# Altium schematic sheet exhaust-fan-control-circuit.SchDoc
size A4
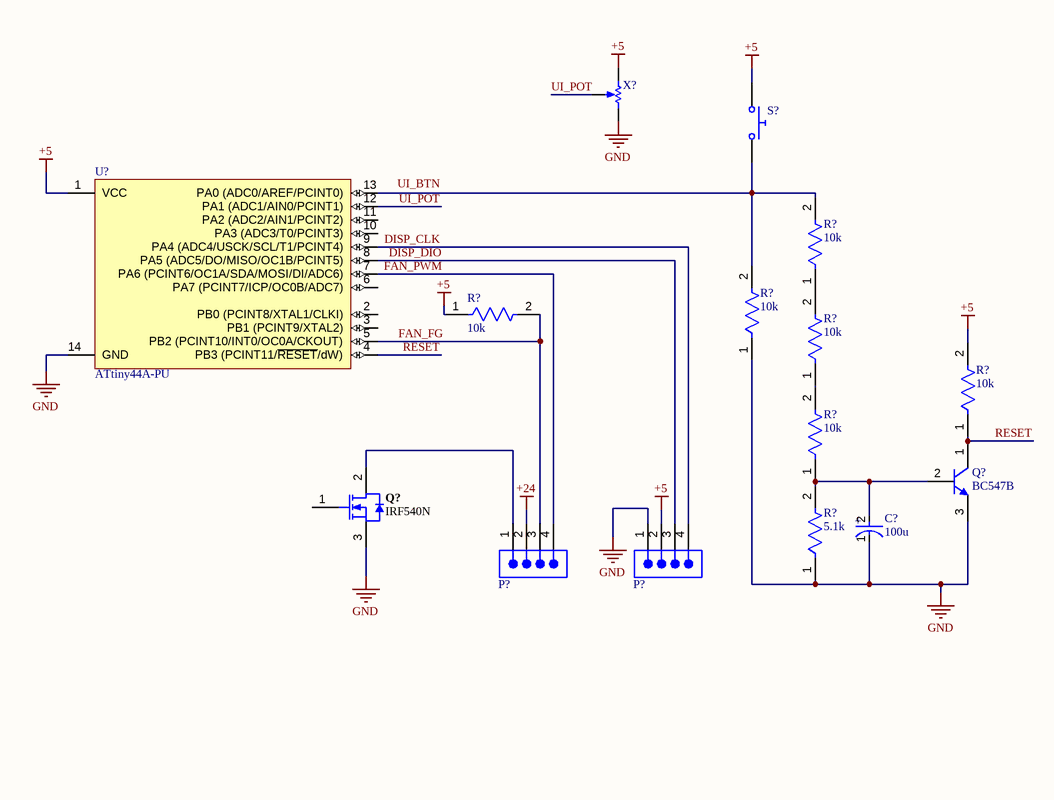
[diagram p0: exhaust-fan-control-circuit.SchDoc]

## Parts
(Parts that share a designator on the sheet are numbered #1, #2 ... from top to bottom, then left to right.)
C?  100u  [FP-UHW1E222MHD-MFG]
P?#1  (no value)  [SMTC-TSW-104-08-X-S]
P?#2  (no value)  [SMTC-TSW-104-08-X-S]
Q?#1  BC547B  [ONSC-TO-92-3-29-11]
Q?#2  IRF540N  [VISH-TO-220AB-3_A]
R?#1  10k  [FP-MBB0207-MFG]
R?#2  10k  [FP-MBB0207-MFG]
R?#3  10k  [FP-MBB0207-MFG]
R?#4  10k  [FP-MBB0207-MFG]
R?#5  10k  [FP-MBB0207-MFG]
R?#6  10k  [FP-MBB0207-MFG]
R?#7  5.1k  [FP-MBB0207-MFG]
S?  Push Button Normally Opened  (value not drawn)
U?  ATtiny44A-PU  [14P3]
X?  Potentiometer  (value not drawn)

## Nets
+5: P?#2.2 R?#2.1 R?#5.2 S?.1 U?.1(VCC) X?.1(TOP)
+24: P?#1.2
GND: C?.1(C) P?#2.1 Q?#1.3(E) Q?#2.3(S) R?#3.1 R?#7.1 U?.14(GND) X?.2(BOT)
DISP_CLK: P?#2.4 U?.9(PA4_(ADC4/USCK/SCL/T1/PCINT4))
DISP_DIO: P?#2.3 U?.8(PA5_(ADC5/DO/MISO/OC1B/PCINT5))
FAN_FG: P?#1.3 R?#2.2 U?.5(PB2_(PCINT10/INT0/OC0A/CKOUT))
FAN_PWM: P?#1.4 U?.7(PA6_(PCINT6/OC1A/SDA/MOSI/DI/ADC6))
RESET: Q?#1.1(C) R?#5.1 U?.4(PB3_(PCINT11/~{RESET}/dW))
UI_POT: U?.12(PA1_(ADC1/AIN0/PCINT1)) X?.3(TAP)
NetC?_2: C?.2(A) Q?#1.2(B) R?#6.1 R?#7.2
NetP?#1_1: P?#1.1 Q?#2.2(D)
NetR?#1_1: R?#1.1 R?#4.2
NetR?#1_2: R?#1.2 R?#3.2 S?.2 U?.13(PA0_(ADC0/AREF/PCINT0))
NetR?#4_1: R?#4.1 R?#6.2

Not connected (* = marked no-connect by the designer): Q?#2 1(G); U? 2(PB0_(PCINT8/XTAL1/CLKI)) 3(PB1_(PCINT9/XTAL2)) 6(PA7_(PCINT7/ICP/OC0B/ADC7)) 10(PA3_(ADC3/T0/PCINT3)) 11(PA2_(ADC2/AIN1/PCINT2))

## Notes on the sheet
- Labels drawn without touching a wire or pin: UI_BTN
- DWG. NO.
- REV.
- SHT.
- THIS DOCUMENT AND THE DATA DISCLOSED HEREIN OR HEREWITH IS THE PROPERTY OF ALTIUM LIMITED AND MAY BE FREELY DISTRIBUTED IN WHOLE. NO RIGHTS ARE RESERVED OR EXPRESS OR IMPLIED WARANTEE GIVEN.
- REVISION
- DESCRIPTION
- DATE
- APPROVED
- ENG:
- APPROVALS
- PROJECT
- DSN:
- CHK:
- REFERENCE DOCUMENTS
- PROJECT REVISION:
- TITLE
- DOCUMENT REVISION:
- DESIGN ITEM:
- BOM:
- FAB DWG:
- PCB DWG:
- ASSY DWG:
- SCALE:
- SIZE
- B
- CAGE CODE
- FILE NAME
- DWG NO.
- SHEET
- OF
- REV
- (in symbol CMP-12462-000038-1) +

## Library data of the parts
C? = CMP-12462-000038-1: CAP ALUM 2200UF 20% 25V RADIAL; Capacitance: 2.2mF; Ripple Current: 3.2A; Impedance: 15mR; Life (Hours): 10000Hour; Tolerance: 20%; Packaging: Bulk; Case/Package: Radial; Min Operating Temperature: -40°C; Height - Seated (Max): 1.063inch; Max Operating Temperature: 105°C; Series: HW; Lead Pitch: 0.197inch; RoHS Compliant: Yes; Voltage Rating: 25V; Package Quantity: 100; Mount: Through Hole
P?#1 P?#2 = CMP-1024-00357-1: 0.025" SQ Post Header, Through-hole, Vertical, -55 to 125 degC, 2.54 mm Pitch, 4-Pin, Male, RoHS; Manufacturer: Samtec; PartNumber: TSW-104-08-G-S; Pitch: 2.54 mm; RoHS: True; ComponentLink3URL: http://www.samtec.com/documents/webfiles/cpdf/TSW-XXX-XX-XXX-X-XX-XXX-MKT.pdf; Mounting Technology: Through-hole; ComponentLink2URL: http://www.samtec.com/documents/webfiles/pdf/TSW_TH.PDF; ComponentLink1URL: http://www.samtec.com; ComponentLink3Description: Package Specification; PackageVersion: DM, 8/1988; ComponentLink2Description: Datasheet; PackageReference: TSW-104-08-X-S; PackageDescription: .025[0.64] SQ. Post Terminal Strip Assembly; ComponentLink1Description: Manufacturer URL; Temperature Range: -55 to 125 degC; DatasheetVersion: F-214; Orientation: Vertical
Q?#1 = CMP-1048-01467-1: Amplifier Transistor, NPN Silicon, 3-Pin TO-92, Bulk Box; Manufacturer: On Semiconductor; IC Continuous (A): 0.1; fT Min (MHz): 150; DatasheetVersion: Rev. 7; ComponentLink1URL: http://www.onsemi.com/; Polarity: NPN; RoHS: FALSE; ComponentLink1Description: Manufacturer URL; Packing: Bulk Box; PackageDescription: 3-Pin Transistor Outline, Body 4.825 x 3.685 mm, Pitch 1.27 mm; ComponentLink3URL: http://www.onsemi.cn/pub_link/Collateral/2N6426-D.PDF; ComponentLink2Description: Datasheet; PackageVersion: Rev. AM; PackageReference: TO-92-3-29-11_AM_SL; ComponentLink3Description: Package Specification; Mounting Technology: Through Hole; PartNumber: BC547B; ComponentLink2URL: http://www.onsemi.com/pub_link/Collateral/BC546-D.PDF
Q?#2 = CMP-2000-06461-1: Power MOSFET, 100 VDS, -55 to 175 degC, 3-Pin TO-220AB, RoHS, Tube; Manufacturer: Vishay; Typical Turn-Off Delay Time: 53ns; Channel Mode: Enhancement; Unit Weight: 0.211644oz; Transistor Type: 1N-Channel; Vgs - Gate-Source Voltage: 20V; Transistor Polarity: N-Channel; Vds - Drain-Source Breakdown Voltage: 100V; Configuration: Single; Number of Channels: 1Channel; Pd - Power Dissipation: 150W; Brand: VishaySemiconductors; Rds On - Drain-Source Resistance: 77mOhms; Id - Continuous Drain Current: 28A; Rise Time: 44ns; Fall Time: 43ns; Typical Turn-On Delay Time: 11ns; &lt;PCN&gt;: http://www.mouser.com/PCN/Vishay_SIL_0182015.pdf; Maximum Operating Temperature: +175C; Product Category: MOSFET; Datasheet URL: http://www.vishay.com/docs/91021/91021.pdf; Length: 10.51mm; Height: 9.01mm; Factory Pack Quantity: 50; Width: 4.7mm; Packaging: Tube; Package Reference: TO-220AB-3; Package / Case: TO-220-3; Mounting Style: ThroughHole; Manufacturer URL: http://www.vishay.com/; Mounting Technology: ThroughHole; Package URL: http://www.vishay.com/docs/71195/to220ab.pdf; RoHS: NoRoHSVersionAvailable; Technology: Si; Minimum Operating Temperature: -55C; Package Description: 3-Pin Flange Mount, Body 10.275 x 4.45 mm, Pitch 2.54 mm; Datasheet Version: Rev. B, 03/2011
R?#1-R?#7 = CMP-02408-000035-1: RES 10K OHM 0.6W 1% AXIAL; Voltage Rating: 300V; Resistance: 10kR; Max Power Dissipation: 600mW; Temperature Coefficient: 50ppm/°C; Radiation Hardening: No; Case/Package: Conformal; Termination: Axial; Military Standard: Not; Length: 6.5mm; Voltage Rating (DC): 300V; RoHS Compliant: Yes; Number of Terminations: 2; Packaging: Tape and Reel; Features: Automotive AEC-Q200; Tolerance: 1%; Min Operating Temperature: -55°C; Power Rating: 600mW; Lead Free: Lead Free; Resistor Type: Metal Film; Construction: Cylindrical; Series: MBB 0207 - Professional; Max Operating Temperature: 155°C; Diameter: 2.5mm; Resistance Tolerance: 1%; Contact Plating: Tin; Technology: THIN FILM
S? = Push Button NO: closed: 0; Rclosed: 1m; Ropen: 1Meg; SimulationGenericComponent: True
U? = CMP-0093-00042-2: 8-bit AVR Microcontroller,  20MHz, 1.8-5.5V, 4KB Flash, 256 Bytes EEPROM, 256 Bytes SRAM, 14-pin PDIP, Industrial Grade (-40°C to 85°C), Pb-Free; PackageVersion: revB, Oct-2010; ComponentLink3URL: http://www.atmel.com/dyn/resources/prod_documents/8183S.pdf; ComponentLink2Description: ATtiny24A/44A/84A Datasheet; ComponentLink2URL: http://www.atmel.com/dyn/resources/prod_documents/doc8183.pdf; ComponentLink3Description: ATtiny24A/44A/84A Summary; RevisionNote: DatasheetVersion updated. URLs added.; Code_JEDEC: MS-001-AA; DatasheetVersion: revD, Apr-2011; ComponentLink1URL: http://www.atmel.com/; PackageDescription: 14-Lead Plastic Dual In-Line, 300 mil/7.62 mm Wide Body (PDIP); ComponentLink1Description: Manufacturer URL; PackageReference: 14P3
X? = Potentiometer: value: 1k; position: 0.5; SimulationGenericComponent: True